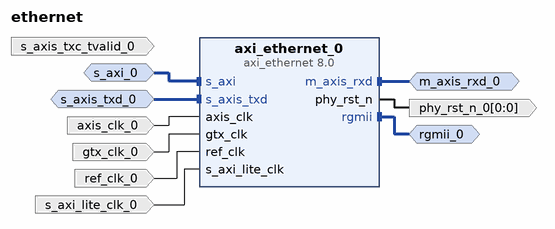
[diagram p0: block diagram of the top level]
# Vivado block design ethernet, xc7k325tffg676-2, Vivado 2025.2
create_bd_design ethernet

create_bd_intf_port -mode Master -vlnv xilinx.com:interface:axis_rtl:1.0 m_axis_rxd_0
create_bd_intf_port -mode Slave -vlnv xilinx.com:interface:axis_rtl:1.0 s_axis_txd_0
set_property -dict [list \
  CONFIG.HAS_TKEEP 1 \
  CONFIG.HAS_TLAST 1 \
  CONFIG.HAS_TREADY 1 \
  CONFIG.HAS_TSTRB 0 \
  CONFIG.LAYERED_METADATA undef \
  CONFIG.TDATA_NUM_BYTES 4 \
  CONFIG.TDEST_WIDTH 0 \
  CONFIG.TID_WIDTH 0 \
  CONFIG.TUSER_WIDTH 0 \
] [get_bd_intf_ports s_axis_txd_0]
create_bd_intf_port -mode Slave -vlnv xilinx.com:interface:aximm_rtl:1.0 s_axi_0
set_property -dict [list \
  CONFIG.ADDR_WIDTH 18 \
  CONFIG.ARUSER_WIDTH 0 \
  CONFIG.AWUSER_WIDTH 0 \
  CONFIG.BUSER_WIDTH 0 \
  CONFIG.DATA_WIDTH 32 \
  CONFIG.HAS_BRESP 1 \
  CONFIG.HAS_BURST 0 \
  CONFIG.HAS_CACHE 0 \
  CONFIG.HAS_LOCK 0 \
  CONFIG.HAS_PROT 0 \
  CONFIG.HAS_QOS 0 \
  CONFIG.HAS_REGION 0 \
  CONFIG.HAS_RRESP 1 \
  CONFIG.HAS_WSTRB 1 \
  CONFIG.ID_WIDTH 0 \
  CONFIG.NUM_READ_OUTSTANDING 1 \
  CONFIG.NUM_READ_THREADS 1 \
  CONFIG.NUM_WRITE_OUTSTANDING 1 \
  CONFIG.NUM_WRITE_THREADS 1 \
  CONFIG.PROTOCOL AXI4LITE \
  CONFIG.READ_WRITE_MODE READ_WRITE \
  CONFIG.RUSER_BITS_PER_BYTE 0 \
  CONFIG.RUSER_WIDTH 0 \
  CONFIG.WUSER_BITS_PER_BYTE 0 \
  CONFIG.WUSER_WIDTH 0 \
] [get_bd_intf_ports s_axi_0]
create_bd_intf_port -mode Master -vlnv xilinx.com:interface:rgmii_rtl:1.0 rgmii_0
create_bd_port -dir I -type clk ref_clk_0
create_bd_port -dir I -type clk gtx_clk_0
set_property -dict {CONFIG.FREQ_HZ 125000000 CONFIG.FREQ_TOLERANCE_HZ 1000000 CONFIG.PHASE 0} [get_bd_ports gtx_clk_0]
create_bd_port -dir I -type clk axis_clk_0
create_bd_port -dir O -from 0 -to 0 -type rst phy_rst_n_0
create_bd_port -dir I -type clk s_axi_lite_clk_0
create_bd_port -dir I s_axis_txc_tvalid_0

create_bd_cell -type ip -vlnv xilinx.com:ip:axi_ethernet:8.0 axi_ethernet_0
set_property -dict [list \
  CONFIG.Number_of_Table_Entries 1 \
  CONFIG.PHY_TYPE RGMII \
  CONFIG.RXVLAN_STRP false \
  CONFIG.RXVLAN_TAG true \
  CONFIG.TXVLAN_STRP true \
  CONFIG.axiliteclkrate 125 \
  CONFIG.axisclkrate 125 \
] [get_bd_cells axi_ethernet_0]

# ---- connections ----

connect_bd_intf_net [get_bd_intf_ports m_axis_rxd_0] [get_bd_intf_pins axi_ethernet_0/m_axis_rxd]
connect_bd_intf_net [get_bd_intf_ports rgmii_0] [get_bd_intf_pins axi_ethernet_0/rgmii]
connect_bd_intf_net -intf_net s_axi_0_1 [get_bd_intf_ports s_axi_0] [get_bd_intf_pins axi_ethernet_0/s_axi]
connect_bd_intf_net -intf_net s_axis_txd_0_1 [get_bd_intf_ports s_axis_txd_0] [get_bd_intf_pins axi_ethernet_0/s_axis_txd]
connect_bd_net [get_bd_pins axi_ethernet_0/phy_rst_n] [get_bd_ports phy_rst_n_0]
connect_bd_net -net axis_clk_0_1 [get_bd_ports axis_clk_0] [get_bd_pins axi_ethernet_0/axis_clk]
connect_bd_net -net gtx_clk_0_1 [get_bd_ports gtx_clk_0] [get_bd_pins axi_ethernet_0/gtx_clk]
connect_bd_net -net ref_clk_0_1 [get_bd_ports ref_clk_0] [get_bd_pins axi_ethernet_0/ref_clk]
connect_bd_net -net s_axi_lite_clk_0_1 [get_bd_ports s_axi_lite_clk_0] [get_bd_pins axi_ethernet_0/s_axi_lite_clk]

# ---- address map ----
exclude_bd_addr_seg -offset 0x00000 -range 1 -target_address_space [get_bd_addr_spaces s_axi_0] [get_bd_addr_segs axi_ethernet_0/s_axi/Reg0]

validate_bd_design
save_bd_design
